# EAGLE design IR breakout (EAGLE 9.6.2)
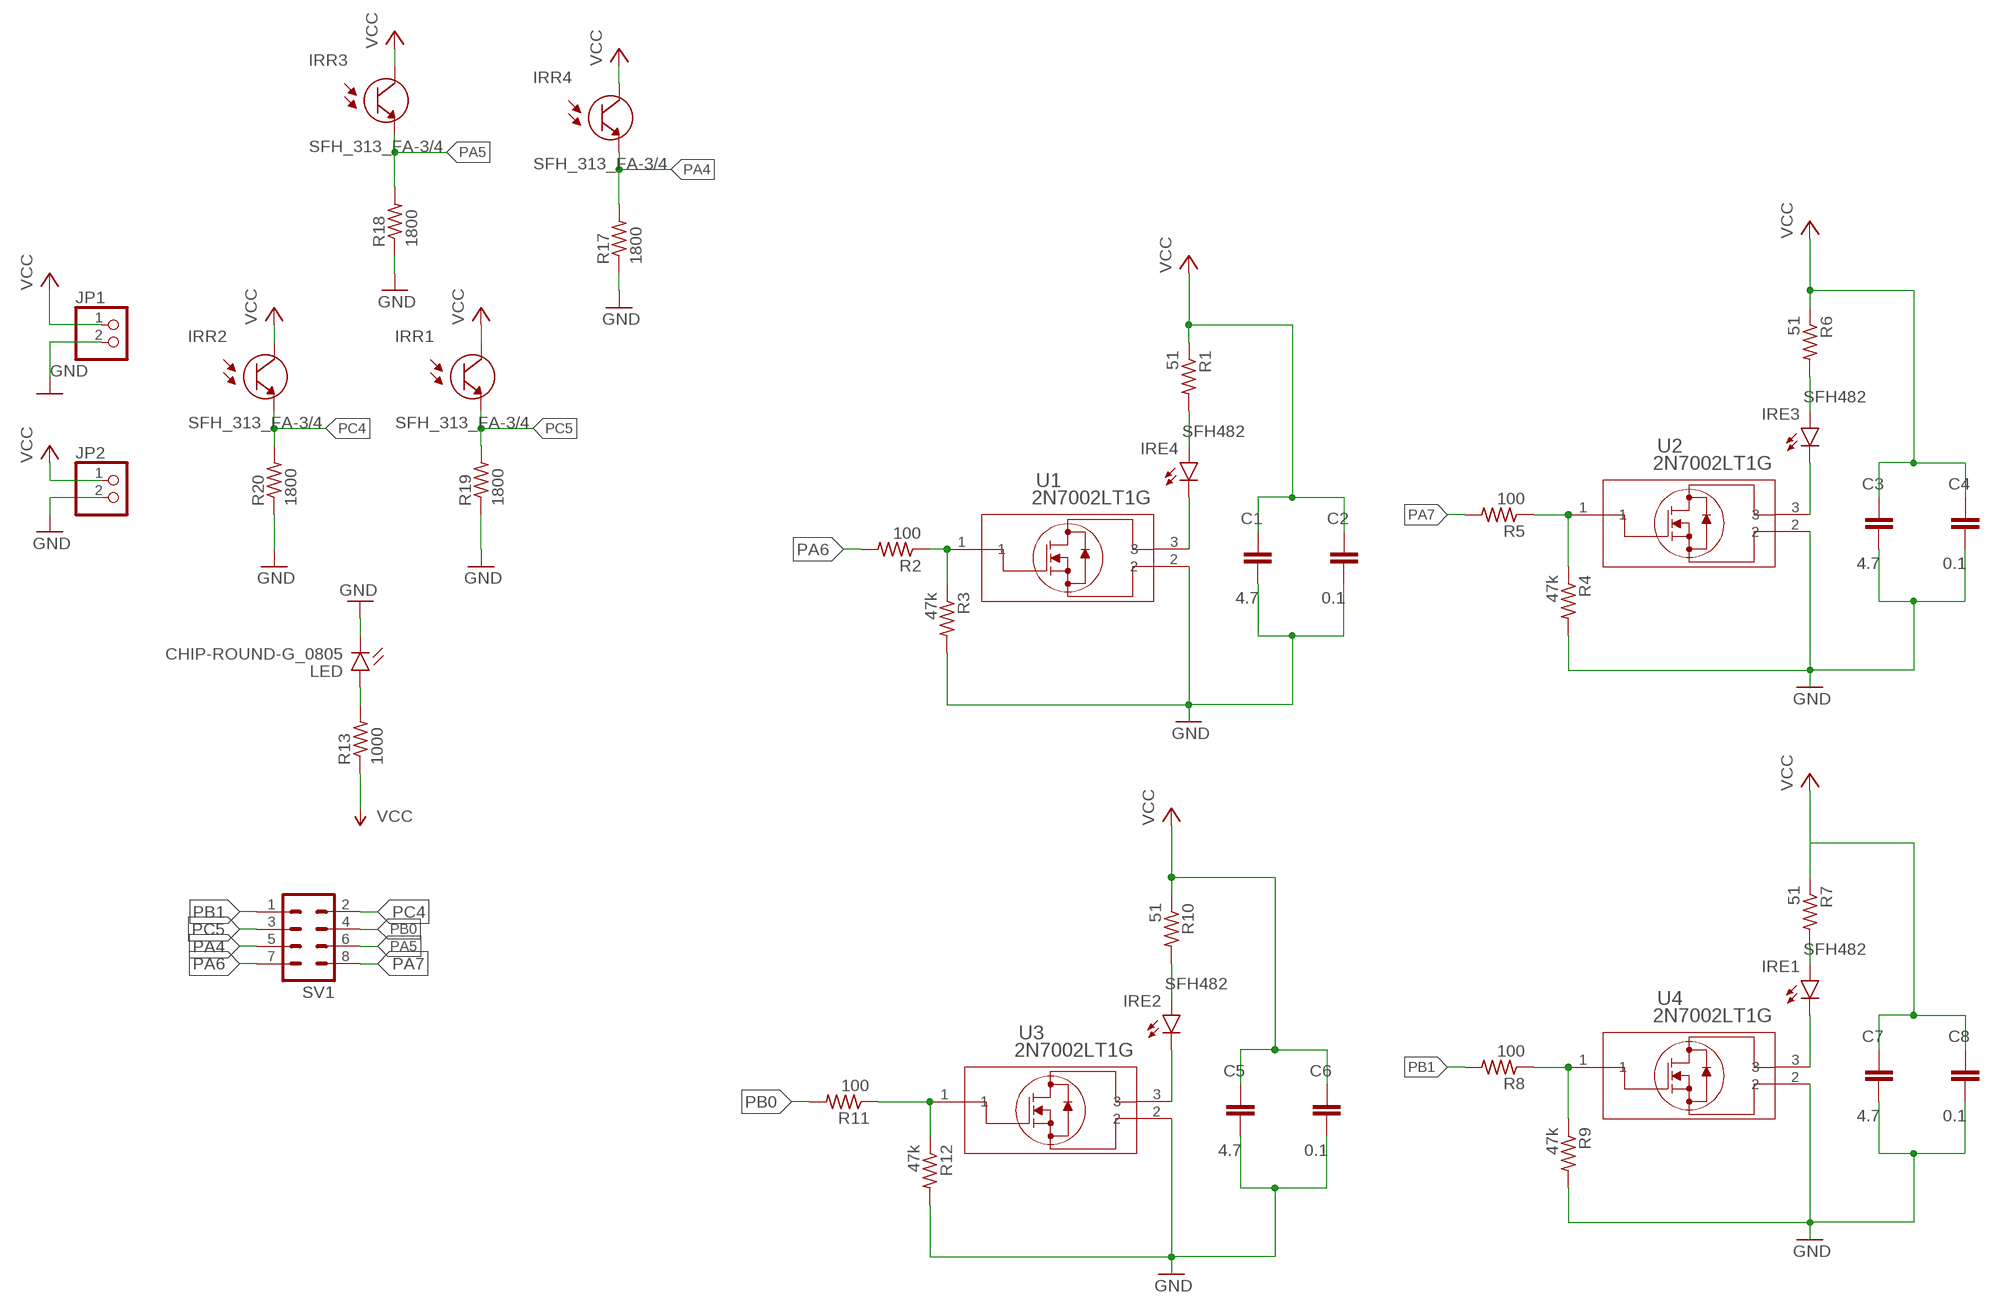
[diagram p0: schematic, sheet 1]

## Parts
C1  4.7  CC0805KRX7R9BB104  [CAP_0805]
C2  0.1  CC0805KRX7R9BB104  [CAP_0805]
C3  4.7  CC0805KRX7R9BB104  [CAP_0805]
C4  0.1  CC0805KRX7R9BB104  [CAP_0805]
C5  4.7  CC0805KRX7R9BB104  [CAP_0805]
C6  0.1  CC0805KRX7R9BB104  [CAP_0805]
C7  4.7  CC0805KRX7R9BB104  [CAP_0805]
C8  0.1  CC0805KRX7R9BB104  [CAP_0805]
IRE1  SFH482  [SFH482]
IRE2  SFH482  [SFH482]
IRE3  SFH482  [SFH482]
IRE4  SFH482  [SFH482]
IRR1  SFH_313_FA-3/4  [XDCR_SFH_313_FA-3/4]
IRR2  SFH_313_FA-3/4  [XDCR_SFH_313_FA-3/4]
IRR3  SFH_313_FA-3/4  [XDCR_SFH_313_FA-3/4]
IRR4  SFH_313_FA-3/4  [XDCR_SFH_313_FA-3/4]
JP1  PINHD-1X2  [1X02]
JP2  PINHD-1X2  [1X02]
LED  CHIP-ROUND-G_0805  [LEDC2012X105N_RND-G]
R1  51  CRCW08050000Z0EA  [RES_0805]
R2  100  CRCW08050000Z0EA  [RES_0805]
R3  47k  CRCW08050000Z0EA  [RES_0805]
R4  47k  CRCW08050000Z0EA  [RES_0805]
R5  100  CRCW08050000Z0EA  [RES_0805]
R6  51  CRCW08050000Z0EA  [RES_0805]
R7  51  CRCW08050000Z0EA  [RES_0805]
R8  100  CRCW08050000Z0EA  [RES_0805]
R9  47k  CRCW08050000Z0EA  [RES_0805]
R10  51  CRCW08050000Z0EA  [RES_0805]
R11  100  CRCW08050000Z0EA  [RES_0805]
R12  47k  CRCW08050000Z0EA  [RES_0805]
R13  1000  CRCW08050000Z0EA  [RES_0805]
R17  1800  CRCW08050000Z0EA  [RES_0805]
R18  1800  CRCW08050000Z0EA  [RES_0805]
R19  1800  CRCW08050000Z0EA  [RES_0805]
R20  1800  CRCW08050000Z0EA  [RES_0805]
SV1  MA04-2  [MA04-2]
U1  2N7002LT1G  [SOT-23_3L_ONS]
U2  2N7002LT1G  [SOT-23_3L_ONS]
U3  2N7002LT1G  [SOT-23_3L_ONS]
U4  2N7002LT1G  [SOT-23_3L_ONS]

## Nets
GND: C1.2 C2.2 C3.2 C4.2 C5.2 C6.2 C7.2 C8.2 JP1.2 JP2.2 LED.C R3.2 R4.2 R9.2 R12.2 R17.1 R18.1 R19.1 R20.1 U1.2 U2.2 U3.2 U4.2
N$1: IRE3.K(C) U2.3
N$2: IRE4.K(C) U1.3
N$3: R2.1 R3.1 U1.1
N$4: IRE4.A R1.2
N$5: IRE2.A R10.2
N$6: R11.1 R12.1 U3.1
N$7: IRE3.A R6.2
N$8: LED.A R13.2
N$14: R4.1 R5.1 U2.1
N$15: IRE2.K(C) U3.3
N$18: IRE1.K(C) U4.3
N$19: IRE1.A R7.2
N$20: R8.1 R9.1 U4.1
PA4: IRR4.1(E) R17.2 SV1.5
PA5: IRR3.1(E) R18.2 SV1.6
PA6: R2.2 SV1.7
PA7: R5.2 SV1.8
PB0: R11.2 SV1.4
PB1: R8.2 SV1.1
PC4: IRR2.1(E) R20.2 SV1.2
PC5: IRR1.1(E) R19.2 SV1.3
VCC: C1.1 C2.1 C3.1 C4.1 C5.1 C6.1 C7.1 C8.1 IRR1.2(C) IRR2.2(C) IRR3.2(C) IRR4.2(C) JP1.1 JP2.1 R1.1 R6.1 R7.1 R10.1 R13.1

## Library data of the parts
C1-C8 = Resistor_Capacitor:CC0805KRX7R9BB104: CAP CER 0.1UF 50V X7R 0805 Manufacturer's datasheet <http://www.yageo.com/documents/recent/UPY-GPHC_X7R_6.3V-to-50V_18.pdf>; CREATED_BY: PCBLayout.com; DIGIKEY_PART_NUMBER: 311-1140-2-ND; MANUFACTURER: Yageo; MPN: CC0805KRX7R9BB104; PACKAGE: SMD 0805
IRE1-IRE4 = led:SFH482: IR LED infrared emitting diode, Infineon
IRR1-IRR4 = new_receiver:SFH_313_FA-3/4: Phototransistor IR Chip Silicon 870nm 2-Pin T-1 3/4; AVAILABILITY: Unavailable; DESCRIPTION: Phototransistors 870nm Top View Radial - 2 Leads; MF: OSRAM Opto; MP: SFH 313 FA-3/4; PACKAGE: Radial-2 Osram Opto; PRICE: None
JP1 JP2 = pinhead:PINHD-1X2: PIN HEADER
LED = LED:CHIP-ROUND-G; CATEGORY: LED; COLOR: GREEN; DESCRIPTION: CHIP LED ROUND; SUB-CATEGORY: CHIP; TYPE: ROUND_TOP
R1-R13 R17-R20 = Resistor_Capacitor:CRCW08050000Z0EA: RES SMD 0 OHM JUMPER 1/8W 0805 Manufacturer's datasheet <http://www.vishay.com/docs/20035/dcrcwe3.pdf>; CREATED_BY: PCBLayout.com; DIGIKEY_PART_NUMBER: 541-0.0ATR-ND; MANUFACTURER: Vishay Dale; MPN: CRCW08050000Z0EA; PACKAGE: SMD 0805
SV1 = con-lstb:MA04-2: PIN HEADER; OC_FARNELL: unknown; OC_NEWARK: unknown
U1-U4 = IR_mosfet:2N7002LT1G; BUILT_BY: EMA_Justin; COPYRIGHT: Copyright (C) 2018 Accelerated Designs. All rights reserved; DATASHEET: https://www.onsemi.com/pub/Collateral/2N7002L-D.PDF; MANUFACTURER_PART_NUMBER: 2N7002LT1G; SOURCELIBRARY: ON_Semiconductor_2020-01-13; VENDOR: ON Semiconductor

## Board
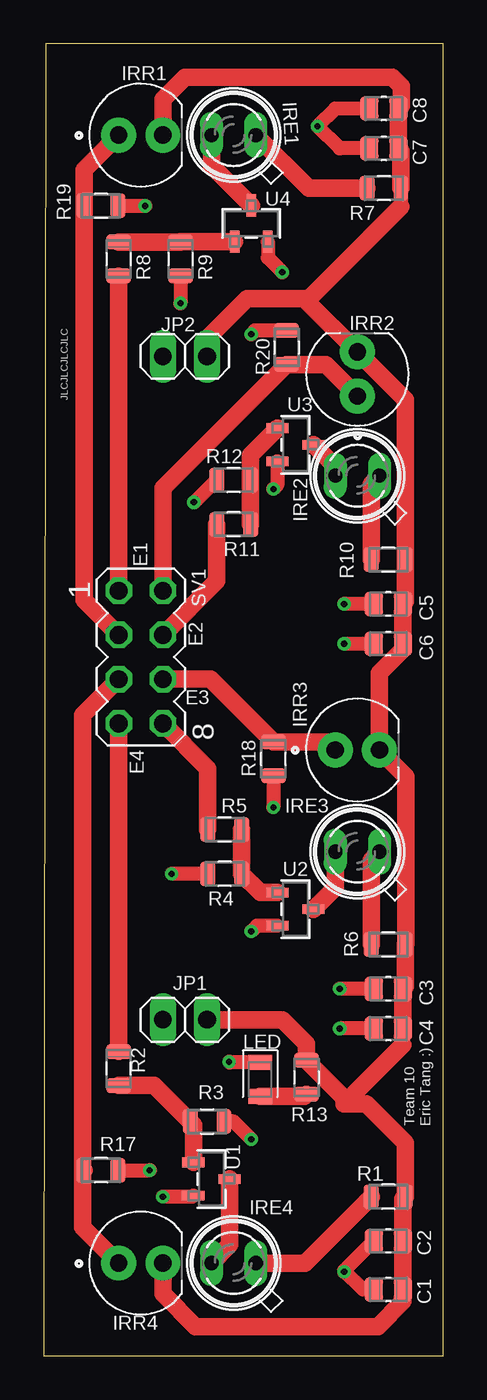
[diagram p1: board, top side]
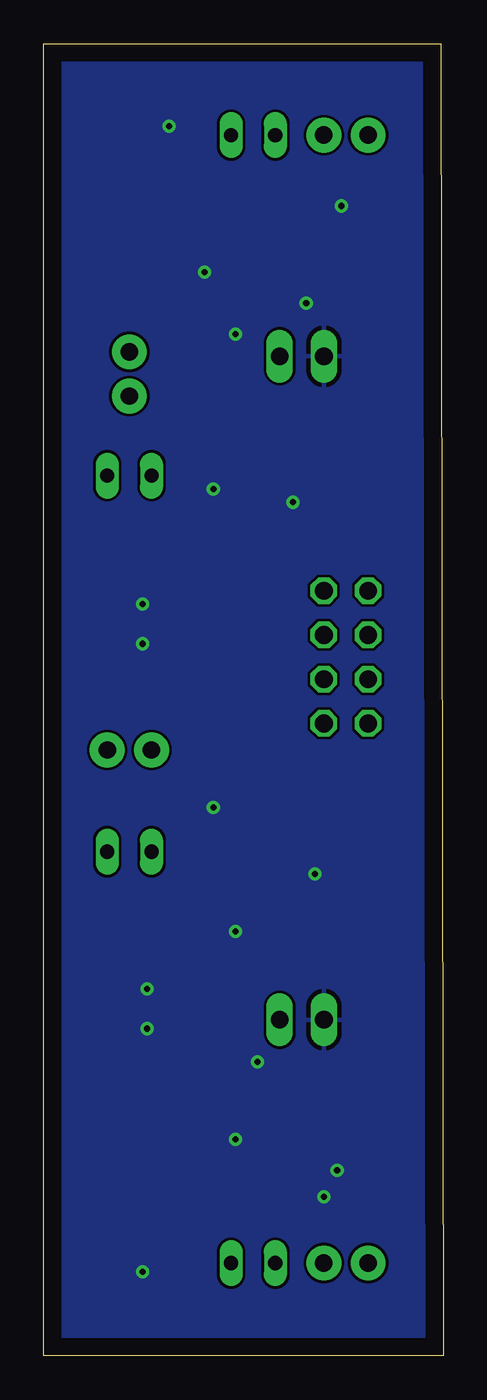
[diagram p2: board, bottom side, seen from below]

Size 22.97 x 75.36 mm. Coordinates in mm from the lower left corner, seen from the top.
Outline: 0,0 22.97,0 22.97,75.36 0.13,75.36 0,0
Copper layers (1*16): Top 0.035mm / dielectric 1.5mm / Bottom 0.035mm
Design rules "default": minimum track width 6mil, minimum drill 0.35mm, track to track 6mil, track to pad 6mil, pad to pad 6mil, via to via 6mil, smd to smd 6mil, copper to edge 40mil, drill to drill 6mil, minimum pad ring 10mil, minimum via ring 8mil, stop-mask expansion 4mil, vias tented up to drill 0mil, thermal gap 10mil

### Footprints (pad centres in the part's own frame; a part is rotated, then mirrored left to right if it is on the bottom)
CAP_0805 = smd 1.05 x 1.38: 1 -0.84,0; 2 0.84,0
SFH482 = drill 0.813 long: A -1.27,0; K 1.27,0
XDCR_SFH_313_FA-3/4 = drill 1 pad 2: 1 -1.27,0; 2 1.27,0
1X02 = drill 1.016 long: 1 -1.27,0; 2 1.27,0
LEDC2012X105N_RND-G = smd 0.862 x 1.362: A 0.975,0; C -0.975,0
RES_0805 = smd 0.87 x 1.42: 1 -0.975,0; 2 0.975,0
MA04-2 = drill 1.016 octagon: 1 -3.81,-1.27; 2 -3.81,1.27; 3 -1.27,-1.27; 4 -1.27,1.27; 5 1.27,-1.27; 6 1.27,1.27; 7 3.81,-1.27; 8 3.81,1.27
SOT-23_3L_ONS = smd 0.559 x 1.27: 1 -0.953,-1.041; 2 0.953,-1.041; 3 0,1.041

### Placement (x,y rotation side)
C1  19.81,3.81 180 top
C2  19.81,6.6 180 top
C3  19.81,21.08 180 top
C4  19.81,18.8 180 top
C5  19.81,43.18 180 top
C6  19.81,40.89 180 top
C7  19.56,69.34 180 top
C8  19.56,71.63 180 top
IRE1  10.92,70.1 180 top
IRE2  18.03,50.55 180 top
IRE3  18.03,28.96 180 top
IRE4  10.92,5.33 180 top
IRR1  5.59,70.1 0 top
IRR2  18.03,56.39 90 top
IRR3  18.03,34.8 0 top
IRR4  5.59,5.33 0 top
JP1  8.13,19.3 180 top
JP2  8.13,57.4 180 top
LED  12.45,15.88 270 top
R1  19.81,9.14 180 top
R2  4.32,16.51 90 top
R3  9.4,13.46 0 top
R4  10.41,27.69 180 top
R5  10.41,30.23 180 top
R6  19.81,23.62 180 top
R7  19.56,67.06 180 top
R8  4.32,62.99 270 top
R9  7.87,62.99 270 top
R10  19.81,45.72 180 top
R11  10.92,47.75 180 top
R12  10.92,50.29 180 top
R13  15.11,16 270 top
R17  3.3,10.67 180 top
R18  13.21,34.29 90 top
R19  3.3,66.04 180 top
R20  13.97,57.91 270 top
SV1  5.59,40.13 270 top
U1  9.65,10.16 270 top
U2  14.48,25.65 270 top
U3  14.48,52.32 270 top
U4  11.94,65.02 0 top

### Tracks (layer width: path | path; a pad name or v marks a point on that pad's centre or on a via)
GND  (via drill 0.35)
  Top 0.813: U3.2 13.44,50.01 v13.21,49.78 | U2.2 12.26,24.7 v11.94,24.38 | U1.2 8.55,9.14 v6.86,9.14 | R19.1 v5.84,66.04 | R17.1 v6.1,10.67 | R18.1 v13.21,31.5 | R4.2 v7.37,27.69 | v11.94,12.45 10.92,13.46 R3.2 | C2.2 17.27,4.9 | 17.27,4.9 v17.27,4.83 | C1.2 18.37,3.81 17.27,4.9 | C3.2 v17.02,21.08 | C4.2 v17.02,18.8 | C5.2 v17.27,43.18 | C6.2 v17.27,40.89 | R20.1 12.15,58.89 v11.94,58.67 | R9.2 v7.87,60.45 | U4.2 12.89,63.06 v13.72,62.23 | C7.2 17.02,69.34 v15.75,70.61 16.76,71.63 C8.2 | R12.2 8.68,49.02 v8.64,49.02 | LED.C 10.71,16.85 v10.67,16.89
  pour Bottom: 0.51,74.93 0.51,0 22.86,0 22.86,74.93
N$1
  Top 1.016: IRE3.K 16.76,26.9 U2.3
N$2
  Top 1.016: U1.3 10.69,6.38 IRE4.K
N$3
  Top 1.016: R2.1 6.35,15.54 R3.1 8.61,13.27 U1.1
N$4
  Top 1.016: R1.2 15.03,5.33 IRE4.A
N$5
  Top 1.016: IRE2.A 18.84,50.08 R10.2
N$6
  Top 1.016: R11.1 R12.1 11.9,51.74 U3.1
N$7
  Top 1.016: IRE3.A 18.84,28.49 R6.2
N$8
  Top 1.016: R13.2 14.99,14.9 LED.A
N$14
  Top 1.016: R5.1 R4.1 12.47,26.61 U2.1
N$15
  Top 1.016: U3.3 16.76,51.08 IRE2.K
N$18
  Top 1.016: U4.3 9.65,68.35 IRE1.K
N$19
  Top 1.016: R7.2 15.24,67.06 IRE1.A
N$20
  Top 1.016: R8.1 R9.1 7.89,63.98 U4.1
PA4
  Top 1.016: IRR4.1 2.25,7.4 2.25,10.59 | 2.25,10.59 R17.2 | SV1.5 2.25,36.8 2.25,10.59
PA5
  Top 1.016: SV1.6 9.61,38.86 R18.2 16.3,35.27 IRR3.1
PA6
  Top 1.016: SV1.7 R2.2
PA7
  Top 1.016: SV1.8 9.44,33.74 R5.2
PB0
  Top 1.016: R11.2 9.95,44.49 SV1.4
PB1
  Top 1.016: R8.2 SV1.1
PC4
  Top 1.016: SV1.2 6.86,49.83 R20.2 16.21,56.94 IRR2.1
PC5
  Top 1.016: IRR1.1 2.33,68.11 R19.2 2.33,43.39 SV1.3
VCC
  Top 0.813: 14.99,60.71 15.11,60.58 | 20.65,3.13 C1.1 | 20.65,9.01 R1.1 | C4.1 20.65,17.86 | 20.83,23.66 R6.1 | 20.79,21.22 C3.1 | 20.65,40.72 C6.1 | R7.1 20.53,66
  Top 1.016: IRR1.2 6.86,72.16 8.13,73.43 20.04,73.43 20.57,72.9 20.57,71.8 C8.1 C7.1 20.53,69.21 R7.1 | JP2.1 9.4,58.42 11.68,60.71 14.99,60.71 | 20.65,3.13 19.2,1.68 8.74,1.68 6.86,3.56 IRR4.2 | C1.1 C2.1 20.65,9.01 | 20.83,23.66 20.83,33.27 IRR3.2 19.3,39.23 20.65,40.57 20.65,40.72 | R6.1 20.79,21.22 | C3.1 C4.1 | C6.1 C5.1 20.79,43.31 R10.1 20.79,54.91 IRR2.2 15.11,60.58 20.53,66 | JP1.1 13.72,19.3 15.11,17.91 R13.1 17.61,14.48 | R1.1 20.79,12.23 18.54,14.48 17.61,14.48 | 17.61,14.48 17.27,14.48 20.65,17.86

### Text on the board
tNames: JLCJLCJLCJLC | E1 | E2 | E3 | E4 | Team 10 / Eric Tang :)